# Altium schematic sheet cover_page.SchDoc
size A4; Date: 1/11/16; Engineer: JBayalas; DocumentNumber: 1; Revision: V1.1; SheetNumber: 1; SheetTotal: 13
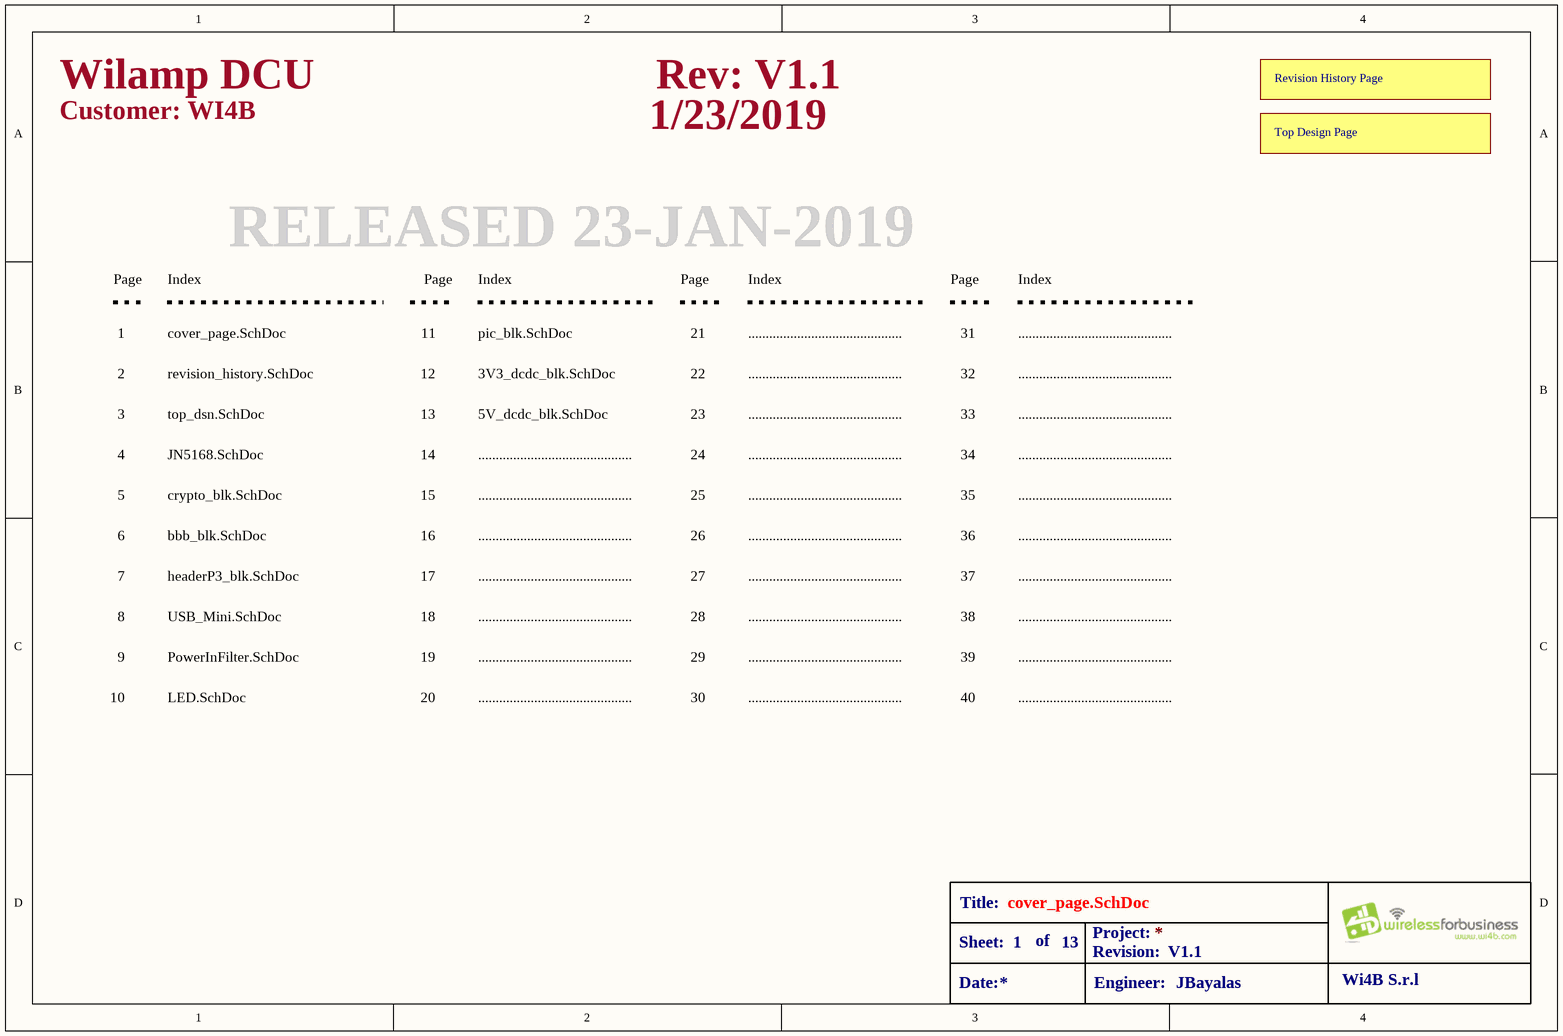
[diagram p0: cover_page.SchDoc]

## Sub-sheets
Revision History Page = revision_history.SchDoc: no entries
Top Design Page = top_dsn.SchDoc: no entries

## Notes on the sheet
- Wilamp DCU
- Rev: V1.1
- Customer: WI4B
- 1/23/2019
- Page
- Index
- RELEASED 23-JAN-2019
- 1
- 2
- revision_history.SchDoc
- cover_page.SchDoc
- 11
- 12
- 3V3_dcdc_blk.SchDoc
- pic_blk.SchDoc
- 21
- 22
- ............................................
- 31
- 32
- 3
- top_dsn.SchDoc
- 13
- 5V_dcdc_blk.SchDoc
- 23
- 33
- 4
- 5
- crypto_blk.SchDoc
- JN5168.SchDoc
- 14
- 15
- 24
- 25
- 34
- 35
- 6
- 7
- bbb_blk.SchDoc
- headerP3_blk.SchDoc
- 16
- 17
- 26
- 27
- 36
- 37
- 8
- USB_Mini.SchDoc
- 18
- 28
- 38
- 9
- 10
- PowerInFilter.SchDoc
- LED.SchDoc
- 19
- 20
- 29
- 30
- 39
- 40
- Title:
- Sheet:
- Date:
- of
- Project:
- Revision:
- Engineer:
- Wi4B S.r.l